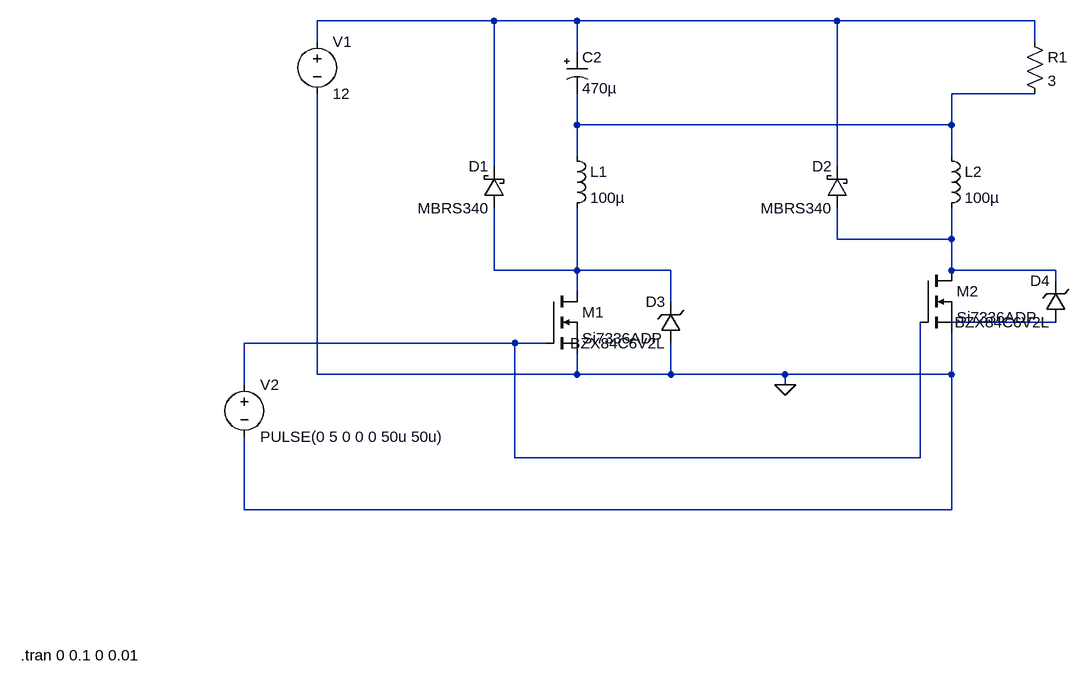
[diagram p0: schematic PWM_Filter.asc]
PWM_Filter.asc, the LTspice schematic file:
Version 4
SHEET 1 1056 896
WIRE 160 -96 -112 -96
WIRE 288 -96 160 -96
WIRE 688 -96 288 -96
WIRE 992 -96 688 -96
WIRE -112 -64 -112 -96
WIRE 992 -64 992 -96
WIRE 288 -48 288 -96
WIRE 992 16 864 16
WIRE 288 64 288 16
WIRE 864 64 864 16
WIRE 864 64 288 64
WIRE 288 112 288 64
WIRE 864 112 864 64
WIRE 160 128 160 -96
WIRE 688 128 688 -96
WIRE 688 240 688 192
WIRE 864 240 864 192
WIRE 864 240 688 240
WIRE 160 288 160 192
WIRE 288 288 288 192
WIRE 288 288 160 288
WIRE 432 288 288 288
WIRE 864 288 864 240
WIRE 1024 288 864 288
WIRE 1024 304 1024 288
WIRE 288 320 288 288
WIRE 432 336 432 288
WIRE 1024 368 864 368
WIRE 192 400 -224 400
WIRE 240 400 192 400
WIRE -112 448 -112 16
WIRE 288 448 288 416
WIRE 288 448 -112 448
WIRE 432 448 432 400
WIRE 432 448 288 448
WIRE 608 448 432 448
WIRE 864 448 864 384
WIRE 864 448 608 448
WIRE -224 464 -224 400
WIRE 608 464 608 448
WIRE 192 576 192 400
WIRE 816 576 816 368
WIRE 816 576 192 576
WIRE -224 656 -224 544
WIRE 864 656 864 448
WIRE 864 656 -224 656
FLAG 608 464 0
SYMBOL schottky 176 192 R180
WINDOW 0 24 64 Left 2
WINDOW 3 24 0 Left 2
SYMATTR InstName D1
SYMATTR Value MBRS340
SYMBOL schottky 704 192 R180
WINDOW 0 24 64 Left 2
WINDOW 3 24 0 Left 2
SYMATTR InstName D2
SYMATTR Value MBRS340
SYMBOL nmos 240 320 R0
SYMATTR InstName M1
SYMATTR Value Si7336ADP
SYMBOL nmos 816 288 R0
SYMATTR InstName M2
SYMATTR Value Si7336ADP
SYMBOL ind 272 96 R0
SYMATTR InstName L1
SYMATTR Value 100µ
SYMATTR SpiceLine Ipk=3.5
SYMBOL ind 848 96 R0
SYMATTR InstName L2
SYMATTR Value 100µ
SYMATTR SpiceLine Ipk=3.5
SYMBOL res 976 -80 R0
SYMATTR InstName R1
SYMATTR Value 3
SYMBOL zener 448 400 R180
WINDOW 0 24 64 Left 2
WINDOW 3 24 0 Left 2
SYMATTR InstName D3
SYMATTR Value BZX84C6V2L
SYMBOL zener 1040 368 R180
WINDOW 0 24 64 Left 2
WINDOW 3 24 0 Left 2
SYMATTR InstName D4
SYMATTR Value BZX84C6V2L
SYMBOL polcap 272 -48 R0
SYMATTR InstName C2
SYMATTR Value 470µ
SYMATTR SpiceLine V=20
SYMBOL voltage -112 -80 R0
WINDOW 123 0 0 Left 2
WINDOW 39 0 0 Left 2
SYMATTR InstName V1
SYMATTR Value 12
SYMBOL voltage -224 448 R0
WINDOW 123 0 0 Left 2
WINDOW 39 0 0 Left 2
SYMATTR InstName V2
SYMATTR Value PULSE(0 5 0 0 0 50u 50u)
TEXT -568 880 Left 2 !.tran 0 0.1 0 0.01

The netlist it stands for:
* PWM_Filter.asc
D1 N004 N001 MBRS340
D2 N003 N001 MBRS340
M1 N004 N006 0 0 Si7336ADP
M2 N003 N006 0 0 Si7336ADP
L1 N002 N004 100µ Ipk=3.5
L2 N002 N003 100µ Ipk=3.5
R1 N001 N002 3
D3 0 N004 BZX84C6V2L
D4 N005 N003 BZX84C6V2L
C2 N001 N002 470µ V=20
V1 N001 0 12
V2 N006 0 PULSE(0 5 0 0 0 50u 50u)
.model D D
.lib standard.dio
.model NMOS NMOS
.model PMOS PMOS
.lib standard.mos
.tran 0 0.1 0 0.01
.backanno
.end